# EAGLE schematic bc-tag-barometer (EAGLE 7.6.0)
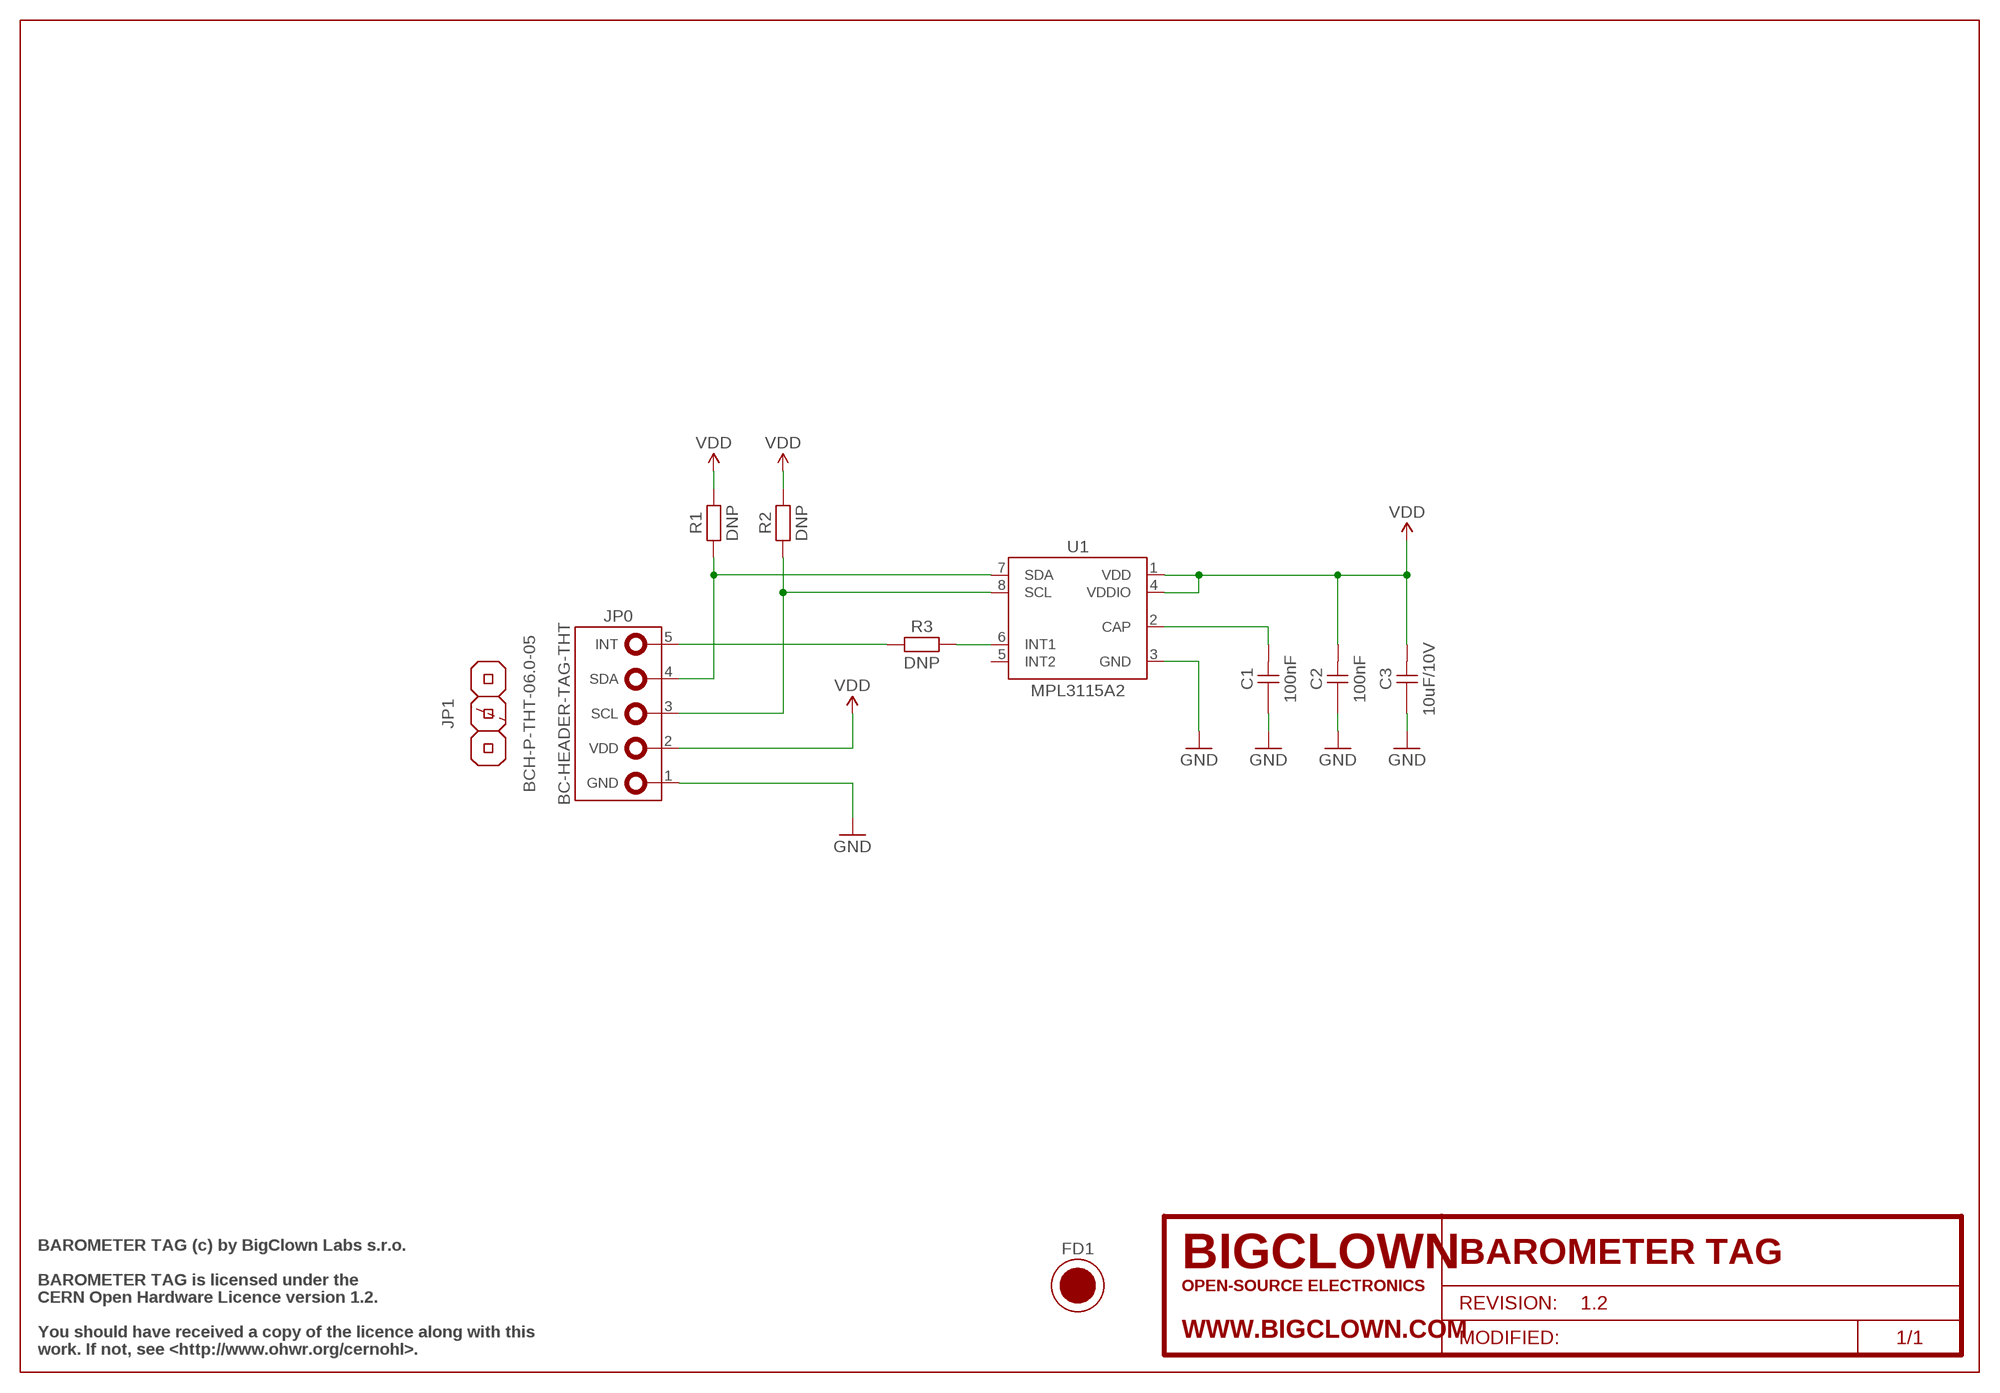
[diagram p0: schematic, sheet 1]

## Parts
C1  100nF  C-0805-100NF  [CAPACITOR-0805_R]
C2  100nF  C-0805-100NF  [CAPACITOR-0805_R]
C3  10uF/10V  C-0805-10UF-10V  [CAPACITOR-0805_R]
FD1  FIDUCIAL  [FIDUCIAL-1MM]
FRAME1  FRAME-SCH/A4L-BRD/A4L  [FRAME-A4L]
JP0  BC-HEADER-TAG-THT  [BC-HEADER-TAG-THT]
JP1  BCH-P-THT-06.0-05  JP-BCH-P-THT-06.0-05  [BCH-P-THT-05]
R1  DNP  R-0805-DNP  [RESISTOR-0805_R]
R2  DNP  R-0805-DNP  [RESISTOR-0805_R]
R3  DNP  R-0805-DNP  [RESISTOR-0805_R]
U1  MPL3115A2  U-MPL3115A2  [MPL3115A2_R]

## Nets
CAP: C1.1 U1.2(CAP)
GND: C1.2 C2.2 C3.2 JP0.1(GND) U1.3(GND)
INT: JP0.5(INT) R3.1
INT1: R3.2 U1.6(INT1)
SCL: JP0.3(SCL) R2.1 U1.8(SCL)
SDA: JP0.4(SDA) R1.1 U1.7(SDA)
VDD: C2.1 C3.1 JP0.2(VDD) R1.2 R2.2 U1.1(VDD) U1.4(VDDIO)
Unconnected: U1.5(INT2)

## Notes on the sheet
- BAROMETER TAG (c) by BigClown Labs s.r.o.
- BAROMETER TAG is licensed under the
- CERN Open Hardware Licence version 1.2.
- You should have received a copy of the licence along with this
- work. If not, see <http://www.ohwr.org/cernohl>.

## Library data of the parts
C1 C2 = bc-capacitor:C-0805-100NF; BCPN: BC-C-0805-100NF
C3 = bc-capacitor:C-0805-10UF-10V; BCPN: BC-C-0805-10UF-10V
FD1 = bc-fiducial:FIDUCIAL; BCPN: -
FRAME1 = bc-frame:FRAME-SCH/A4L-BRD/A4L; BCPN: -; PROJECT_NAME: BAROMETER TAG; PROJECT_REVISION: 1.2
JP0 = bc-header:BC-HEADER-TAG-THT; BCPN: -
JP1 = bc-header:JP-BCH-P-THT-06.0-05; BCPN: BC-JP-BCH-P-THT-06.0-05
R1-R3 = bc-resistor:R-0805-DNP; BCPN: -
U1 = bc-sensor:U-MPL3115A2; BCPN: BC-U-MPL3115A2